# EasyEDA schematic Guindeau_remote.json
TITLE: Sheet_2; REV: 1.0; Date: 2020-11-24; Sheet: 1/1; Drawn By: thegd; Company: Your Company
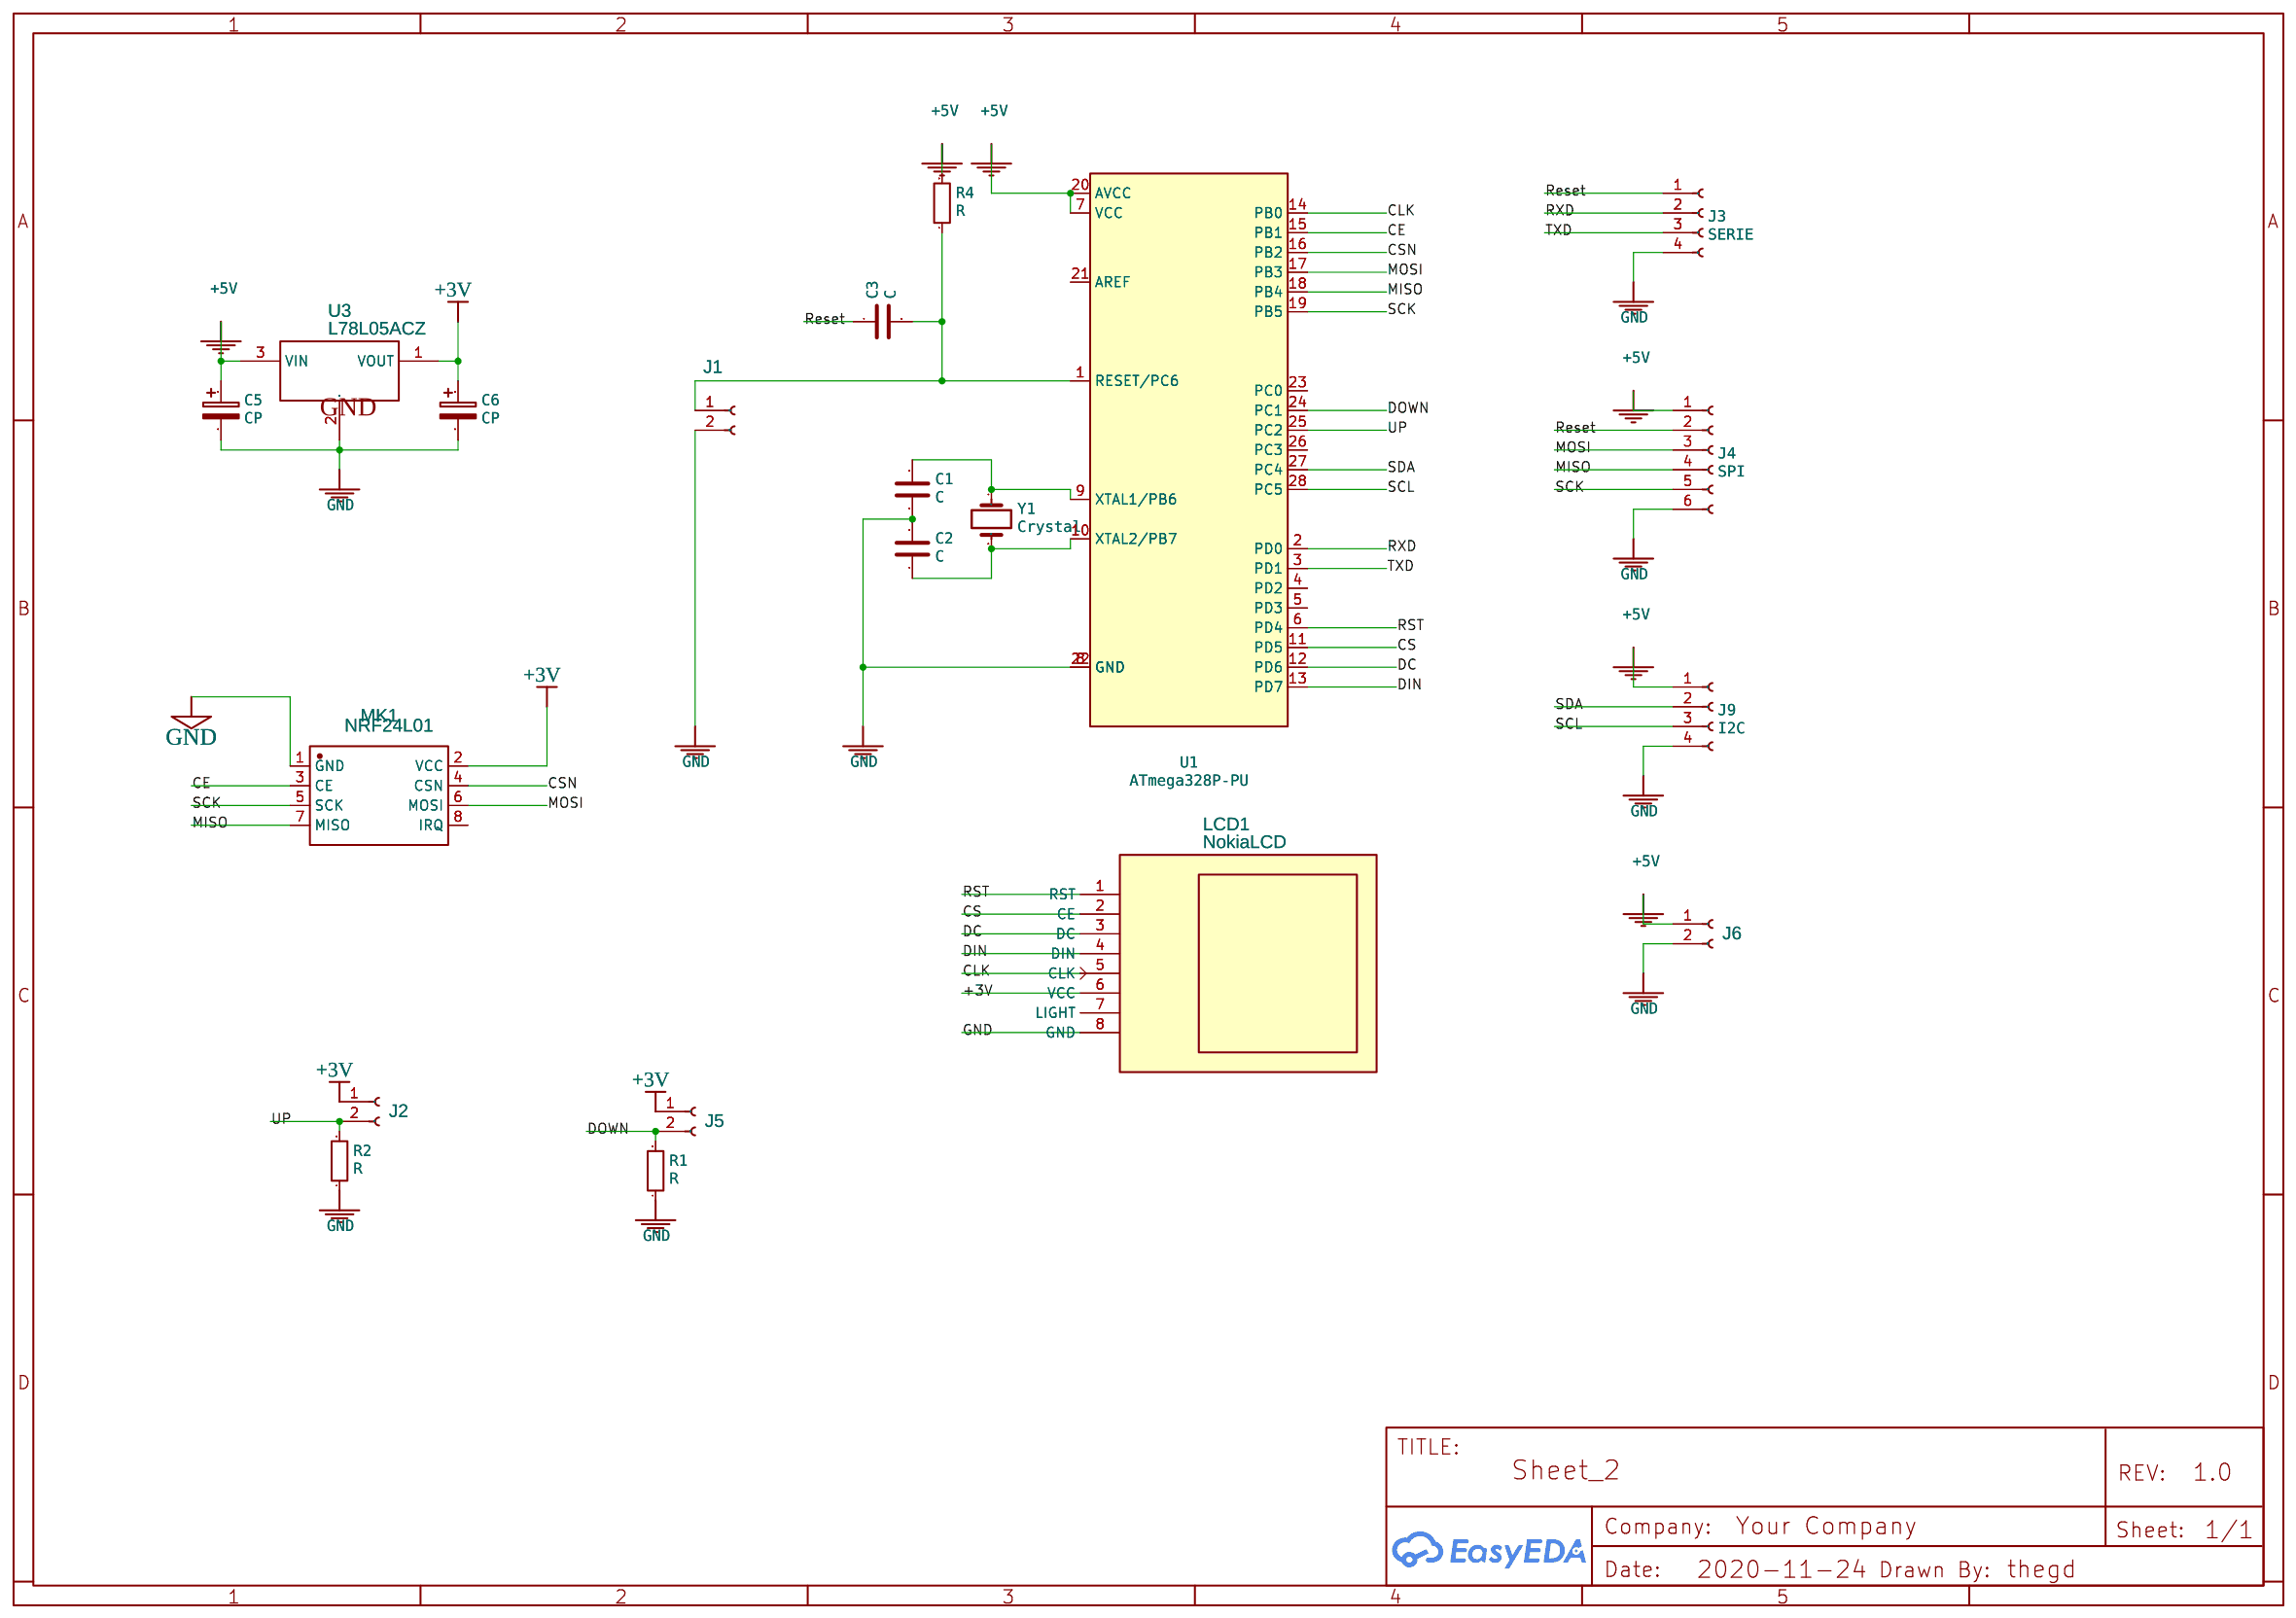
[diagram p0: schematic sheet]

## Parts
C1  C  [C_RADIAL_D5.0MM_H11.0MM_P2.00MM]
C2  C  [C_RADIAL_D5.0MM_H11.0MM_P2.00MM]
C3  C  [C_RADIAL_D5.0MM_H11.0MM_P2.00MM]
C5  CP  [CP_RADIAL_D5.0MM_P2.00MM]
C6  CP  [CP_RADIAL_D5.0MM_P2.00MM]
J1  Connector_Conn_01x02_Female  [PINHEADER_1X02_P2.54MM_VERTICAL]
J2  Connector_Conn_01x02_Female  [PINHEADER_1X02_P2.54MM_VERTICAL]
J3  SERIE  [PINHEADER_1X04_P2.54MM_VERTICAL]
J4  SPI  [PINHEADER_1X06_P2.54MM_VERTICAL]
J5  Connector_Conn_01x02_Female  [PINHEADER_1X02_P2.54MM_VERTICAL]
J6  Connector_Conn_01x02_Female  [PINHEADER_1X02_P2.54MM_VERTICAL]
J9  I2C  [PINHEADER_1X04_P2.54MM_VERTICAL]
LCD1  NokiaLCD  [NOKIA 5110 LCD MODULE (RED PCB)]
MK1  NRF24L01  [WIRELM-SMD_NRF24L01]
R1  R  [R_AXIAL_DIN0204_L3.6MM_D1.6MM_P7.62MM_HORIZONTAL]
R2  R  [R_AXIAL_DIN0204_L3.6MM_D1.6MM_P7.62MM_HORIZONTAL]
R4  R  [R_AXIAL_DIN0204_L3.6MM_D1.6MM_P7.62MM_HORIZONTAL]
U1  ATmega328P-PU  [DIP-28_W7.62MM]
U3  L78L05ACZ  [TO-92-3_L4.9-W3.7-P1.27-L]
Y1  Crystal  [CRYSTAL_HC18-U_VERTICAL]

## Library data of the parts
J1 J2 J5 J6 = Connector_Conn_01x02_Female: Contributor: thegd; Package Display: No
LCD1 = NokiaLCD: sourceId: SsmEWewN5; Manufacturer Part: New SchematicLib; Contributor: perinfrancesco
MK1 = NRF24L01: Supplier: LCSC; Manufacturer: Ai-Thinker; Manufacturer Part: NRF24L01+功率加强版绑定2.4Gwireless module; Supplier Part: C90751
U1 = -: Datasheet: http://ww1.microchip.com/downloads/en/DeviceDoc/ATmega328_P%20AVR%20MCU%20with%20picoPower%20Technology%20Data%20Sheet%2040001984A.pdf
U3 = L78L05ACZ: Supplier: LCSC; Manufacturer: STMicroelectronics; image: //image.lceda.cn/szlcsc/C57900.jpg; Supplier Part: C57900

## Nets
+3V: C6.1 J2.1(Pin) J5.1(Pin) LCD1.6(VCC) MK1.2(VCC) U3.1(VOUT)
+5V: C5.1 J4.1(Pin) J6.1(Pin) J9.1(Pin) R4.2 U1.7(VCC) U1.20(AVCC) U3.3(VIN)
GND: C1.2 C2.1 C5.2 C6.2 J1.2(Pin) J3.4(Pin) J4.6(Pin) J6.2(Pin) J9.4(Pin) LCD1.8(GND) MK1.1(GND) R1.1 R2.1 U1.8(GND) U1.22(GND) U3.2(GND)
CE: MK1.3(CE) U1.15(PB1)
CLK: LCD1.5(CLK) U1.14(PB0)
CS: LCD1.2(CE) U1.11(PD5)
CSN: MK1.4(CSN) U1.16(PB2)
DC: LCD1.3(DC) U1.12(PD6)
DIN: LCD1.4(DIN) U1.13(PD7)
DOWN: J5.2(Pin) R1.2 U1.24(PC1)
MISO: J4.4(Pin) MK1.7(MISO) U1.18(PB4)
MOSI: J4.3(Pin) MK1.6(MOSI) U1.17(PB3)
Reset: C3.1 J3.1(Pin) J4.2(Pin)
RST: LCD1.1(RST) U1.6(PD4)
RXD: J3.2(Pin) U1.2(PD0)
SCK: J4.5(Pin) MK1.5(SCK) U1.19(PB5)
SCL: J9.3(Pin) U1.28(PC5)
SDA: J9.2(Pin) U1.27(PC4)
TXD: J3.3(Pin) U1.3(PD1)
UP: J2.2(Pin) R2.2 U1.25(PC2)
Net-(C1-1): C1.1 U1.9(XTAL1/PB6) Y1.1
Net-(C2-2): C2.2 U1.10(XTAL2/PB7) Y1.2
Net-(C3-2): C3.2 J1.1(Pin) R4.1 U1.1(RESET/PC6)

Not connected (* = marked no-connect by the designer): LCD1 7(LIGHT); MK1 8(IRQ); U1 4(PD2) 5(PD3) 21(AREF) 23(PC0) 26(PC3)
